# EAGLE design brekout_board (EAGLE 9.2.0)
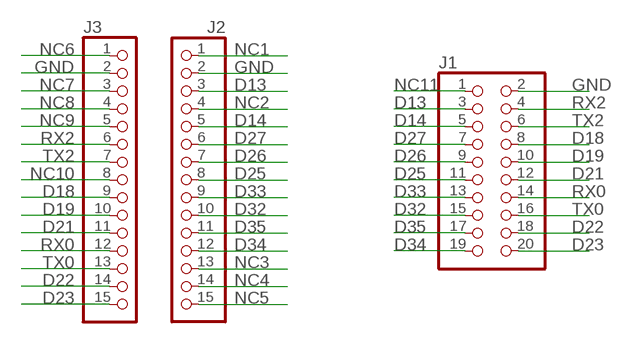
[diagram p0: schematic, sheet 1]

## Parts
J1  PINHD-2X10  [2X10]
J2  PINHD-1X15  [1X15]
J3  PINHD-1X15  [1X15]

## Nets
D13: J1.3 J2.3
D14: J1.5 J2.5
D18: J1.8 J3.9
D19: J1.10 J3.10
D21: J1.12 J3.11
D22: J1.18 J3.14
D23: J1.20 J3.15
D25: J1.11 J2.8
D26: J1.9 J2.7
D27: J1.7 J2.6
D32: J1.15 J2.10
D33: J1.13 J2.9
D34: J1.19 J2.12
D35: J1.17 J2.11
GND: J1.2 J2.2 J3.2
NC1: J2.1
NC2: J2.4
NC3: J2.13
NC4: J2.14
NC5: J2.15
NC6: J3.1
NC7: J3.3
NC8: J3.4
NC9: J3.5
NC10: J3.8
NC11: J1.1
RX0: J1.14 J3.12
RX2: J1.4 J3.6
TX0: J1.16 J3.13
TX2: J1.6 J3.7

## Library data of the parts
J1 = pinhead:PINHD-2X10: PIN HEADER
J2 J3 = pinhead:PINHD-1X15: PIN HEADER

## Board
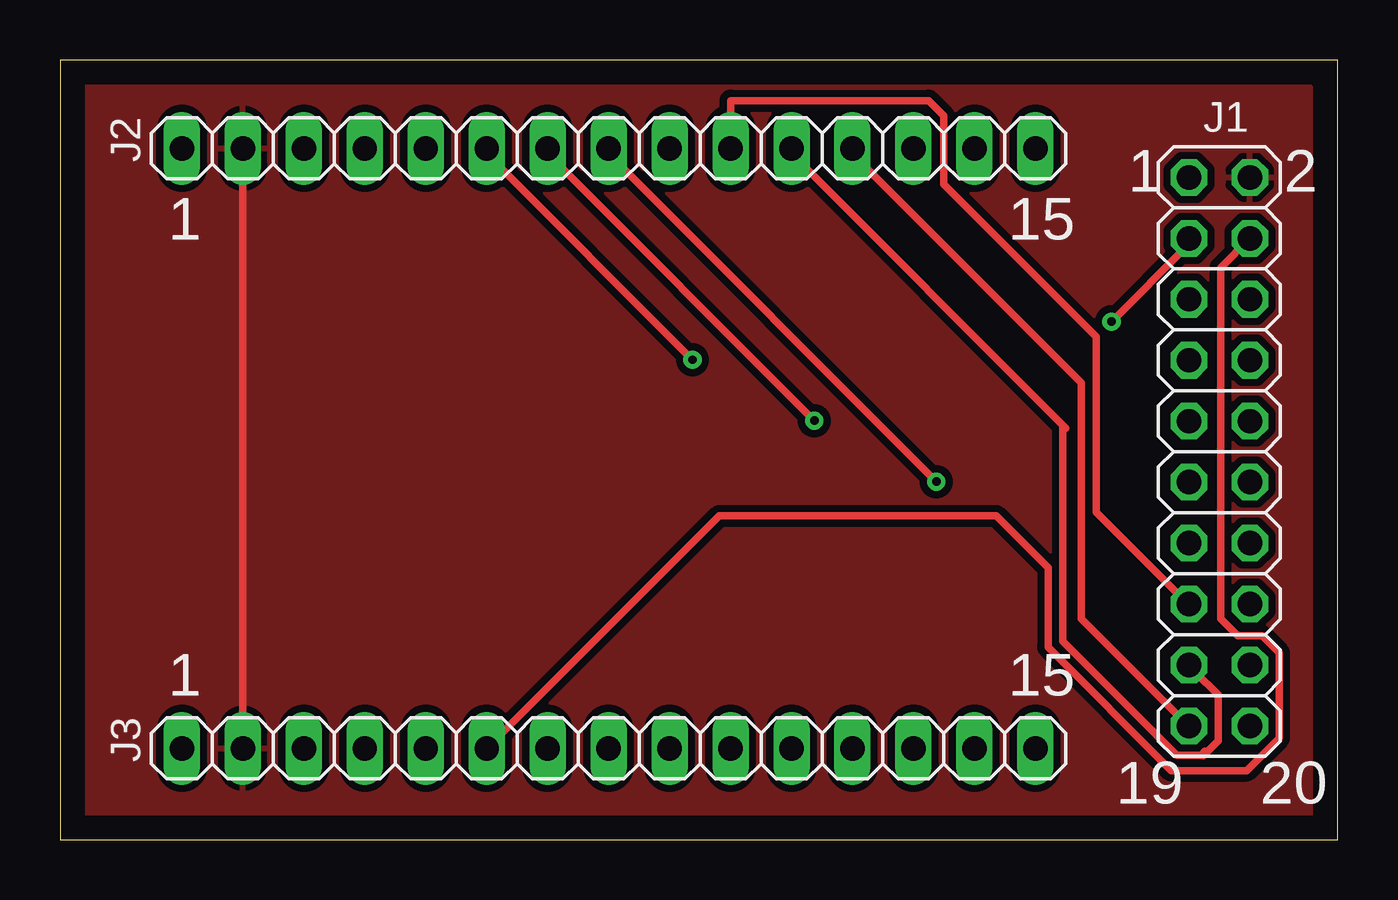
[diagram p1: board, top side]
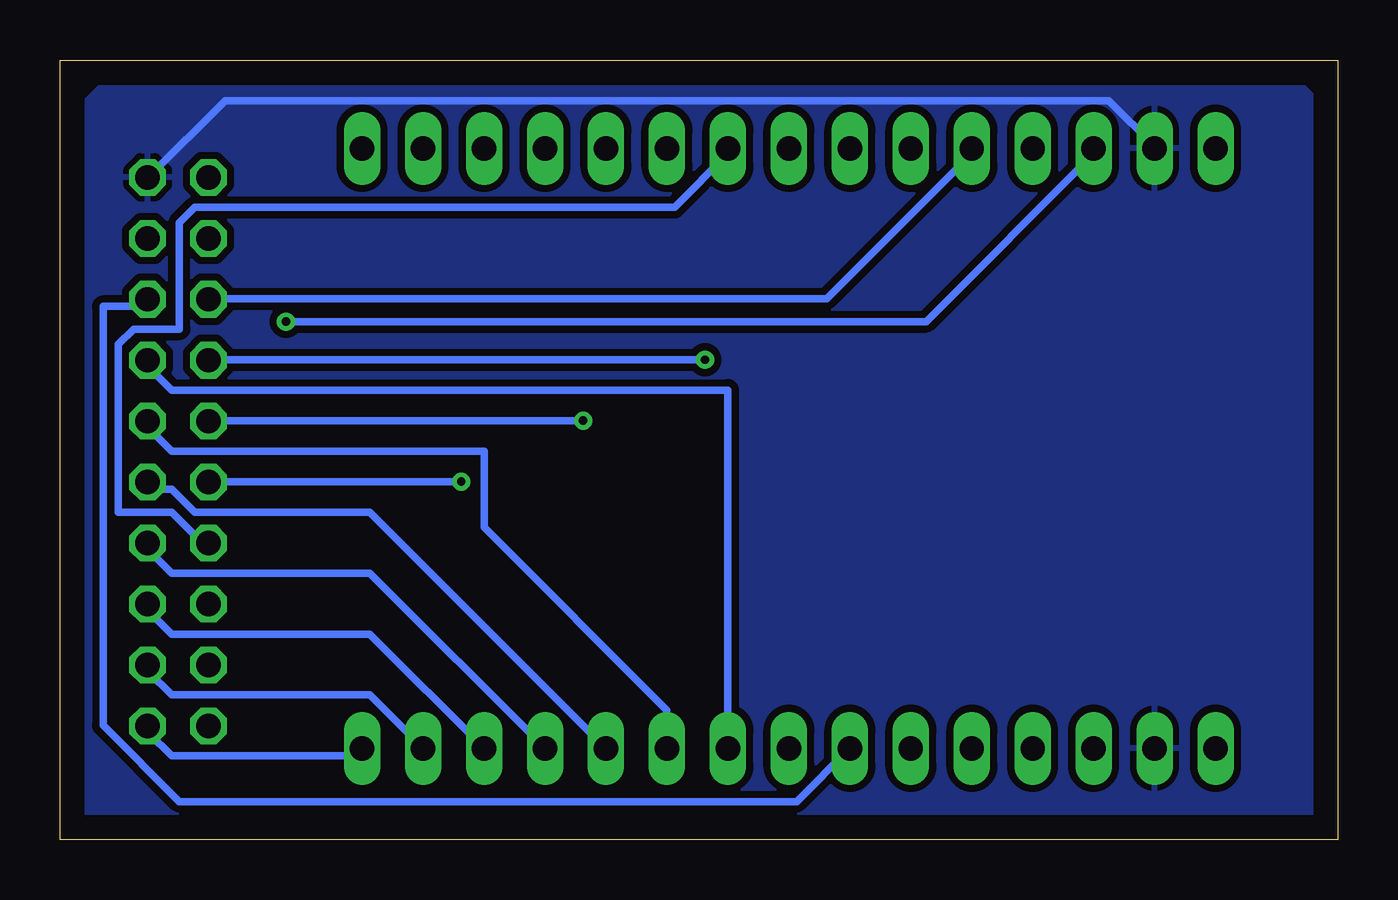
[diagram p2: board, bottom side, seen from below]

Size 53.23 x 32.49 mm. Coordinates in mm from the lower left corner, seen from the top.
Outline: 0,0 53.23,0 53.23,32.49 0,32.49 0,0
Copper layers (1*16): Top 0.035mm / dielectric 1.5mm / Bottom 0.035mm
Design rules "default *": minimum track width 12mil, minimum drill 0.35mm, track to track 12mil, track to pad 12mil, pad to pad 12mil, via to via 12mil, smd to smd 6mil, copper to edge 40mil, drill to drill 6mil, minimum pad ring 10mil, minimum via ring 8mil, stop-mask expansion 4mil, vias tented up to drill 0mil, thermal gap 10mil

### Footprints (pad centres in the part's own frame; a part is rotated, then mirrored left to right if it is on the bottom)
2X10 = drill 1.016 octagon: 1 -11.43,-1.27; 2 -11.43,1.27; 3 -8.89,-1.27; 4 -8.89,1.27; 5 -6.35,-1.27; 6 -6.35,1.27; 7 -3.81,-1.27; 8 -3.81,1.27; 9 -1.27,-1.27; 10 -1.27,1.27; 11 1.27,-1.27; 12 1.27,1.27; 13 3.81,-1.27; 14 3.81,1.27; 15 6.35,-1.27; 16 6.35,1.27; 17 8.89,-1.27; 18 8.89,1.27; 19 11.43,-1.27; 20 11.43,1.27
1X15 = drill 1.016 long: 1 -17.78,0; 2 -15.24,0; 3 -12.7,0; 4 -10.16,0; 5 -7.62,0; 6 -5.08,0; 7 -2.54,0; 8 0,0; 9 2.54,0; 10 5.08,0; 11 7.62,0; 12 10.16,0; 13 12.7,0; 14 15.24,0; 15 17.78,0

### Placement (x,y rotation side)
J1  48.31,16.17 270 top
J2  22.86,28.81 0 top
J3  22.86,3.81 0 top

### Tracks (layer width: path | path; a pad name or v marks a point on that pad's centre or on a via)
D13  (via drill 0.35)
  Top 0.305: v43.81,21.59 46.99,24.77 J1.3
  Bottom 0.305: v43.81,21.59 17.14,21.59 10.16,28.57 J2.3
D14
  Bottom 0.305: J2.5 15.24,28.57 21.27,22.54 46.99,22.54 J1.5
D18
  Bottom 0.305: J3.9 25.4,18.73 48.58,18.73 49.53,19.68 J1.8
D19
  Bottom 0.305: J3.10 27.94,5.4 35.56,13.02 35.56,16.19 48.58,16.19 49.53,17.14 J1.10
D21
  Bottom 0.305: J3.11 40.32,13.65 47.62,13.65 48.58,14.61 49.53,14.61 J1.12
D22
  Bottom 0.305: J3.14 40.32,6.03 48.58,6.03 49.53,6.99 J1.18
D23
  Bottom 0.305: J3.15 40.96,3.49 48.58,3.49 49.53,4.45 J1.20
D25  (via drill 0.35)
  Top 0.305: v36.51,14.92 22.86,28.57 J2.8
  Bottom 0.305: v36.51,14.92 46.99,14.92 J1.11
D26  (via drill 0.35)
  Top 0.305: v31.43,17.46 20.32,28.57 J2.7
  Bottom 0.305: v31.43,17.46 46.99,17.46 J1.9
D27  (via drill 0.35)
  Top 0.305: v26.35,20 17.78,28.57 J2.6
  Bottom 0.305: v26.35,20 46.99,20 J1.7
D32
  Top 0.305: J2.10 27.94,30.8 36.2,30.8 36.83,30.16 36.83,27.3 43.18,20.95 43.18,13.65 46.99,9.84 J1.15
D33
  Bottom 0.305: J2.9 25.4,28.57 27.62,26.35 47.62,26.35 48.26,25.72 48.26,21.27 50.16,21.27 50.8,20.64 50.8,13.65 48.58,13.65 47.31,12.38 J1.13
D34
  Top 0.305: J1.19 46.99,4.76 42.55,9.21 42.55,19.05 33.02,28.57 J2.12
D35
  Top 0.305: 47.62,3.49 47.82,3.68 | 47.82,3.68 48.26,4.13 48.26,6.03 47.31,6.99 J1.17 | 41.78,17.28 30.48,28.57 J2.11 | 41.78,17.28 41.91,17.14 | 47.82,3.68 47.71,3.68 47.55,3.52 46.53,3.52 41.78,8.28 41.78,17.28
GND
  Top 0.305: J2.2 J3.2
  Bottom 0.305: J1.2 49.53,27.62 46.35,30.8 9.53,30.8 7.62,28.89 J2.2
  pour Bottom: 0.5,0.5 52.5,0.5 52.5,30.5 51.5,31.5 1.5,31.5 0.5,30.5
  pour Top: 0.5,1 52.5,1 52.5,31 51.5,32 1.5,32 0.5,31
RX0
  Bottom 0.305: J3.12 40.32,11.11 48.58,11.11 49.53,12.06 J1.14
RX2
  Top 0.305: J3.6 27.47,13.5 39,13.5 41.17,11.33 41.17,8.03 46.31,2.88 49.45,2.88 50.8,4.24 50.8,7.79 50.09,8.5 49.08,8.5 48.36,9.21 48.36,23.84 J1.4
TX0
  Bottom 0.305: J3.13 40.32,8.57 48.58,8.57 49.53,9.53 J1.16
TX2
  Bottom 0.305: J3.7 22.54,1.59 48.26,1.59 51.44,4.76 51.44,22.23 49.85,22.23 J1.6

### Text on the board
tPlace: 1 | 2 | 1 | 15 | 1 | 15 | 19 | 20